# EAGLE design MUX_Adapter (EAGLE 9.5.2)

## Sheet 1 of 2: MUX Routing
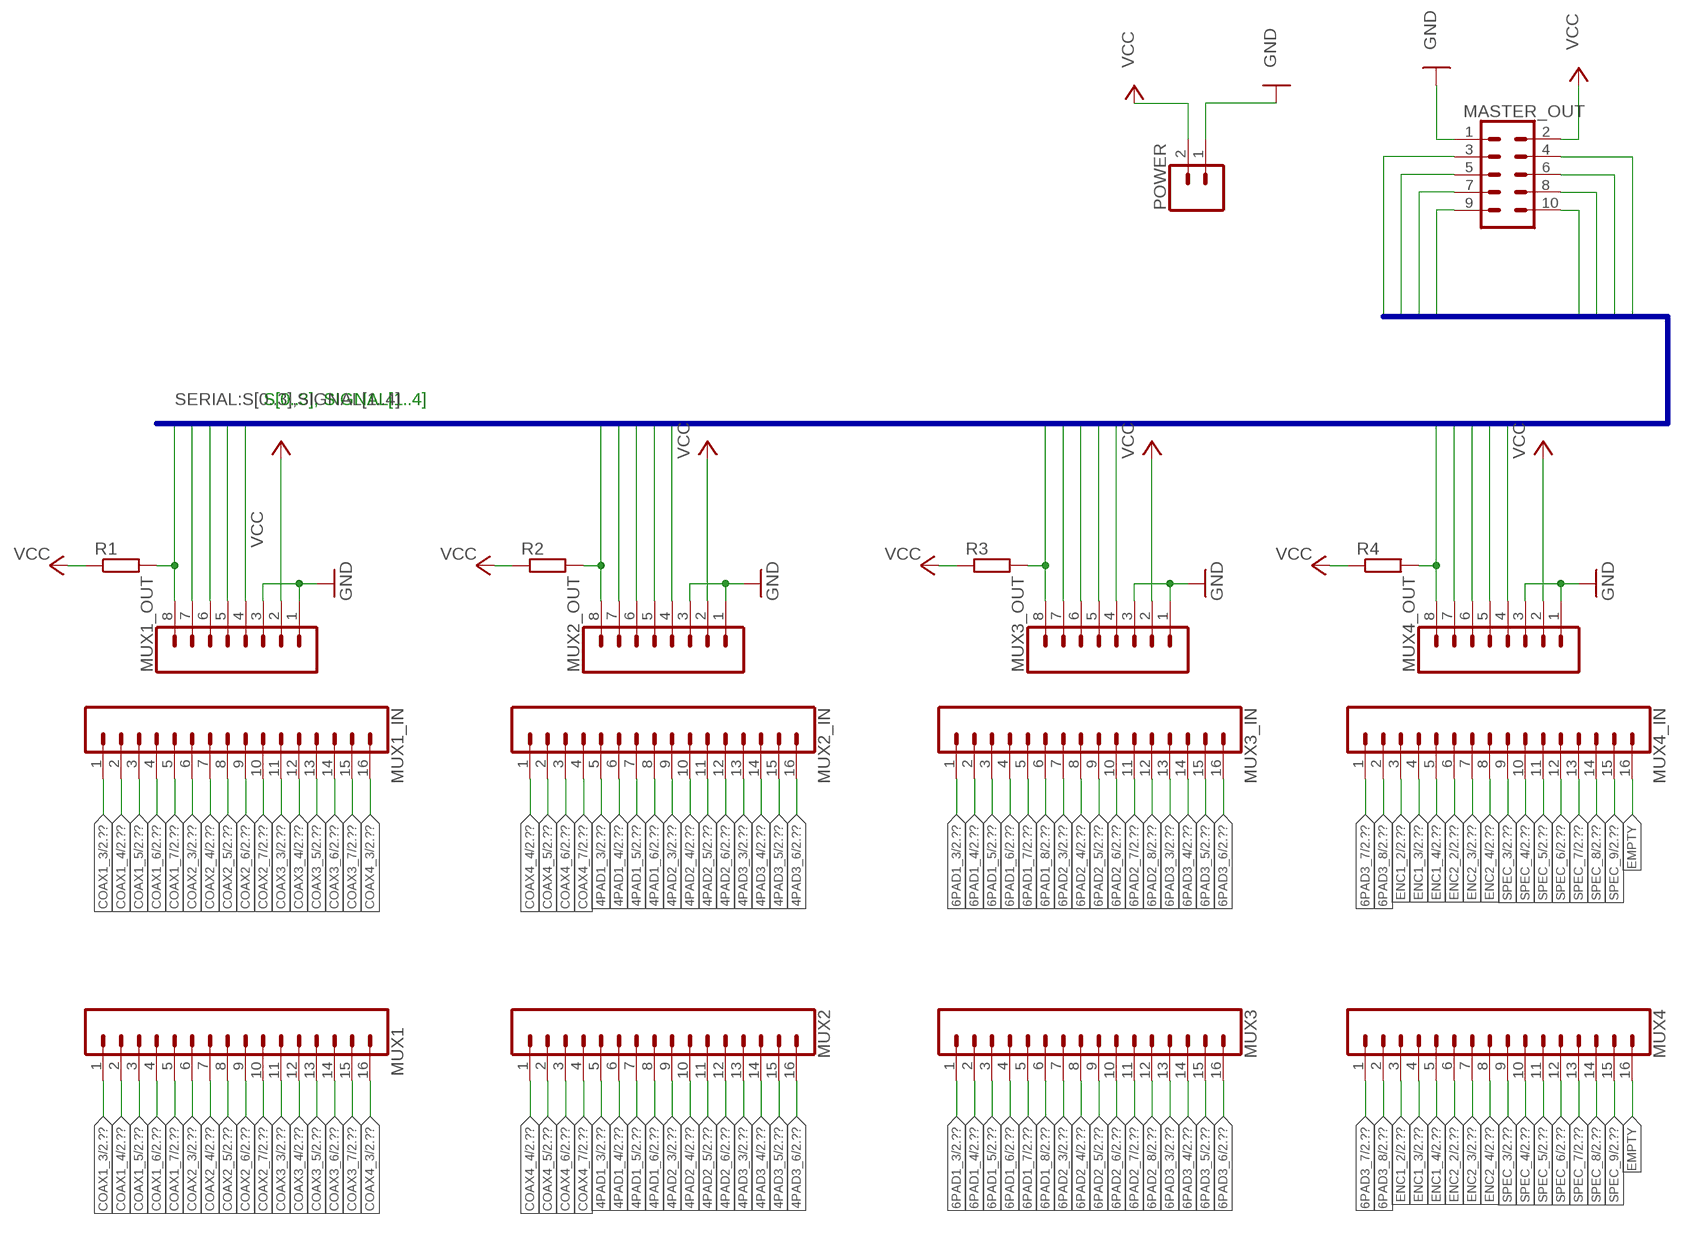
[diagram p0: schematic, sheet 1]

### Parts
MASTER_OUT  CONN_05X2SHD-NS  [2X5-SHROUDED-NS]
MUX1  CONN_16  [1X16]
MUX1_IN  CONN_16  [1X16]
MUX1_OUT  CONN_08"  [1X08]
MUX2  CONN_16  [1X16]
MUX2_IN  CONN_16  [1X16]
MUX2_OUT  CONN_08"  [1X08]
MUX3  CONN_16  [1X16]
MUX3_IN  CONN_16  [1X16]
MUX3_OUT  CONN_08"  [1X08]
MUX4  CONN_16  [1X16]
MUX4_IN  CONN_16  [1X16]
MUX4_OUT  CONN_08"  [1X08]
POWER  CONN_02  [1X02]
R1  R-EU_0207/10  [0207/10]
R2  R-EU_0207/10  [0207/10]
R3  R-EU_0207/10  [0207/10]
R4  R-EU_0207/10  [0207/10]

### Nets
4PAD1_3: MUX2.5 MUX2_IN.5 ; also sheet 2
4PAD1_4: MUX2.6 MUX2_IN.6 ; also sheet 2
4PAD1_5: MUX2.7 MUX2_IN.7 ; also sheet 2
4PAD1_6: MUX2.8 MUX2_IN.8 ; also sheet 2
4PAD2_3: MUX2.9 MUX2_IN.9 ; also sheet 2
4PAD2_4: MUX2.10 MUX2_IN.10 ; also sheet 2
4PAD2_5: MUX2.11 MUX2_IN.11 ; also sheet 2
4PAD2_6: MUX2.12 MUX2_IN.12 ; also sheet 2
4PAD3_3: MUX2.13 MUX2_IN.13 ; also sheet 2
4PAD3_4: MUX2.14 MUX2_IN.14 ; also sheet 2
4PAD3_5: MUX2.15 MUX2_IN.15 ; also sheet 2
4PAD3_6: MUX2.16 MUX2_IN.16 ; also sheet 2
6PAD1_3: MUX3.1 MUX3_IN.1 ; also sheet 2
6PAD1_4: MUX3.2 MUX3_IN.2 ; also sheet 2
6PAD1_5: MUX3.3 MUX3_IN.3 ; also sheet 2
6PAD1_6: MUX3.4 MUX3_IN.4 ; also sheet 2
6PAD1_7: MUX3.5 MUX3_IN.5 ; also sheet 2
6PAD1_8: MUX3.6 MUX3_IN.6 ; also sheet 2
6PAD2_3: MUX3.7 MUX3_IN.7 ; also sheet 2
6PAD2_4: MUX3.8 MUX3_IN.8 ; also sheet 2
6PAD2_5: MUX3.9 MUX3_IN.9 ; also sheet 2
6PAD2_6: MUX3.10 MUX3_IN.10 ; also sheet 2
6PAD2_7: MUX3.11 MUX3_IN.11 ; also sheet 2
6PAD2_8: MUX3.12 MUX3_IN.12 ; also sheet 2
6PAD3_3: MUX3.13 MUX3_IN.13 ; also sheet 2
6PAD3_4: MUX3.14 MUX3_IN.14 ; also sheet 2
6PAD3_5: MUX3.15 MUX3_IN.15 ; also sheet 2
6PAD3_6: MUX3.16 MUX3_IN.16 ; also sheet 2
6PAD3_7: MUX4.1 MUX4_IN.1 ; also sheet 2
6PAD3_8: MUX4.2 MUX4_IN.2 ; also sheet 2
COAX1_3: MUX1.1 MUX1_IN.1 ; also sheet 2
COAX1_4: MUX1.2 MUX1_IN.2 ; also sheet 2
COAX1_5: MUX1.3 MUX1_IN.3 ; also sheet 2
COAX1_6: MUX1.4 MUX1_IN.4 ; also sheet 2
COAX1_7: MUX1.5 MUX1_IN.5 ; also sheet 2
COAX2_3: MUX1.6 MUX1_IN.6 ; also sheet 2
COAX2_4: MUX1.7 MUX1_IN.7 ; also sheet 2
COAX2_5: MUX1.8 MUX1_IN.8 ; also sheet 2
COAX2_6: MUX1.9 MUX1_IN.9 ; also sheet 2
COAX2_7: MUX1.10 MUX1_IN.10 ; also sheet 2
COAX3_3: MUX1.11 MUX1_IN.11 ; also sheet 2
COAX3_4: MUX1.12 MUX1_IN.12 ; also sheet 2
COAX3_5: MUX1.13 MUX1_IN.13 ; also sheet 2
COAX3_6: MUX1.14 MUX1_IN.14 ; also sheet 2
COAX3_7: MUX1.15 MUX1_IN.15 ; also sheet 2
COAX4_3: MUX1.16 MUX1_IN.16 ; also sheet 2
COAX4_4: MUX2.1 MUX2_IN.1 ; also sheet 2
COAX4_5: MUX2.2 MUX2_IN.2 ; also sheet 2
COAX4_6: MUX2.3 MUX2_IN.3 ; also sheet 2
COAX4_7: MUX2.4 MUX2_IN.4 ; also sheet 2
EMPTY: MUX4.16 MUX4_IN.16
ENC1_2: MUX4.3 MUX4_IN.3 ; also sheet 2
ENC1_3: MUX4.4 MUX4_IN.4 ; also sheet 2
ENC1_4: MUX4.5 MUX4_IN.5 ; also sheet 2
ENC2_2: MUX4.6 MUX4_IN.6 ; also sheet 2
ENC2_3: MUX4.7 MUX4_IN.7 ; also sheet 2
ENC2_4: MUX4.8 MUX4_IN.8 ; also sheet 2
GND: MASTER_OUT.1 MUX1_OUT.1 MUX1_OUT.3 MUX2_OUT.1 MUX2_OUT.3 MUX3_OUT.1 MUX3_OUT.3 MUX4_OUT.1 MUX4_OUT.3 POWER.1 ; also sheet 2
S0: MASTER_OUT.3 MUX1_OUT.4 MUX2_OUT.4 MUX3_OUT.4 MUX4_OUT.4
S1: MASTER_OUT.4 MUX1_OUT.5 MUX2_OUT.5 MUX3_OUT.5 MUX4_OUT.5
S2: MASTER_OUT.5 MUX1_OUT.6 MUX2_OUT.6 MUX3_OUT.6 MUX4_OUT.6
S3: MASTER_OUT.6 MUX1_OUT.7 MUX2_OUT.7 MUX3_OUT.7 MUX4_OUT.7
SIGNAL1: MASTER_OUT.7 MUX4_OUT.8 R4.2
SIGNAL2: MASTER_OUT.8 MUX3_OUT.8 R3.2
SIGNAL3: MASTER_OUT.9 MUX2_OUT.8 R2.2
SIGNAL4: MASTER_OUT.10 MUX1_OUT.8 R1.2
SPEC_3: MUX4.9 MUX4_IN.9 ; also sheet 2
SPEC_4: MUX4.10 MUX4_IN.10 ; also sheet 2
SPEC_5: MUX4.11 MUX4_IN.11 ; also sheet 2
SPEC_6: MUX4.12 MUX4_IN.12 ; also sheet 2
SPEC_7: MUX4.13 MUX4_IN.13 ; also sheet 2
SPEC_8: MUX4.14 MUX4_IN.14 ; also sheet 2
SPEC_9: MUX4.15 MUX4_IN.15 ; also sheet 2
VCC: MASTER_OUT.2 MUX1_OUT.2 MUX2_OUT.2 MUX3_OUT.2 MUX4_OUT.2 POWER.2 R1.1 R2.1 R3.1 R4.1 ; also sheet 2

### Buses
SERIAL:S[0..3],SIGNAL[1..4]

### Notes on the sheet
- S[0..3], SIGNAL[1..4]

## Sheet 2 of 2: Connecors
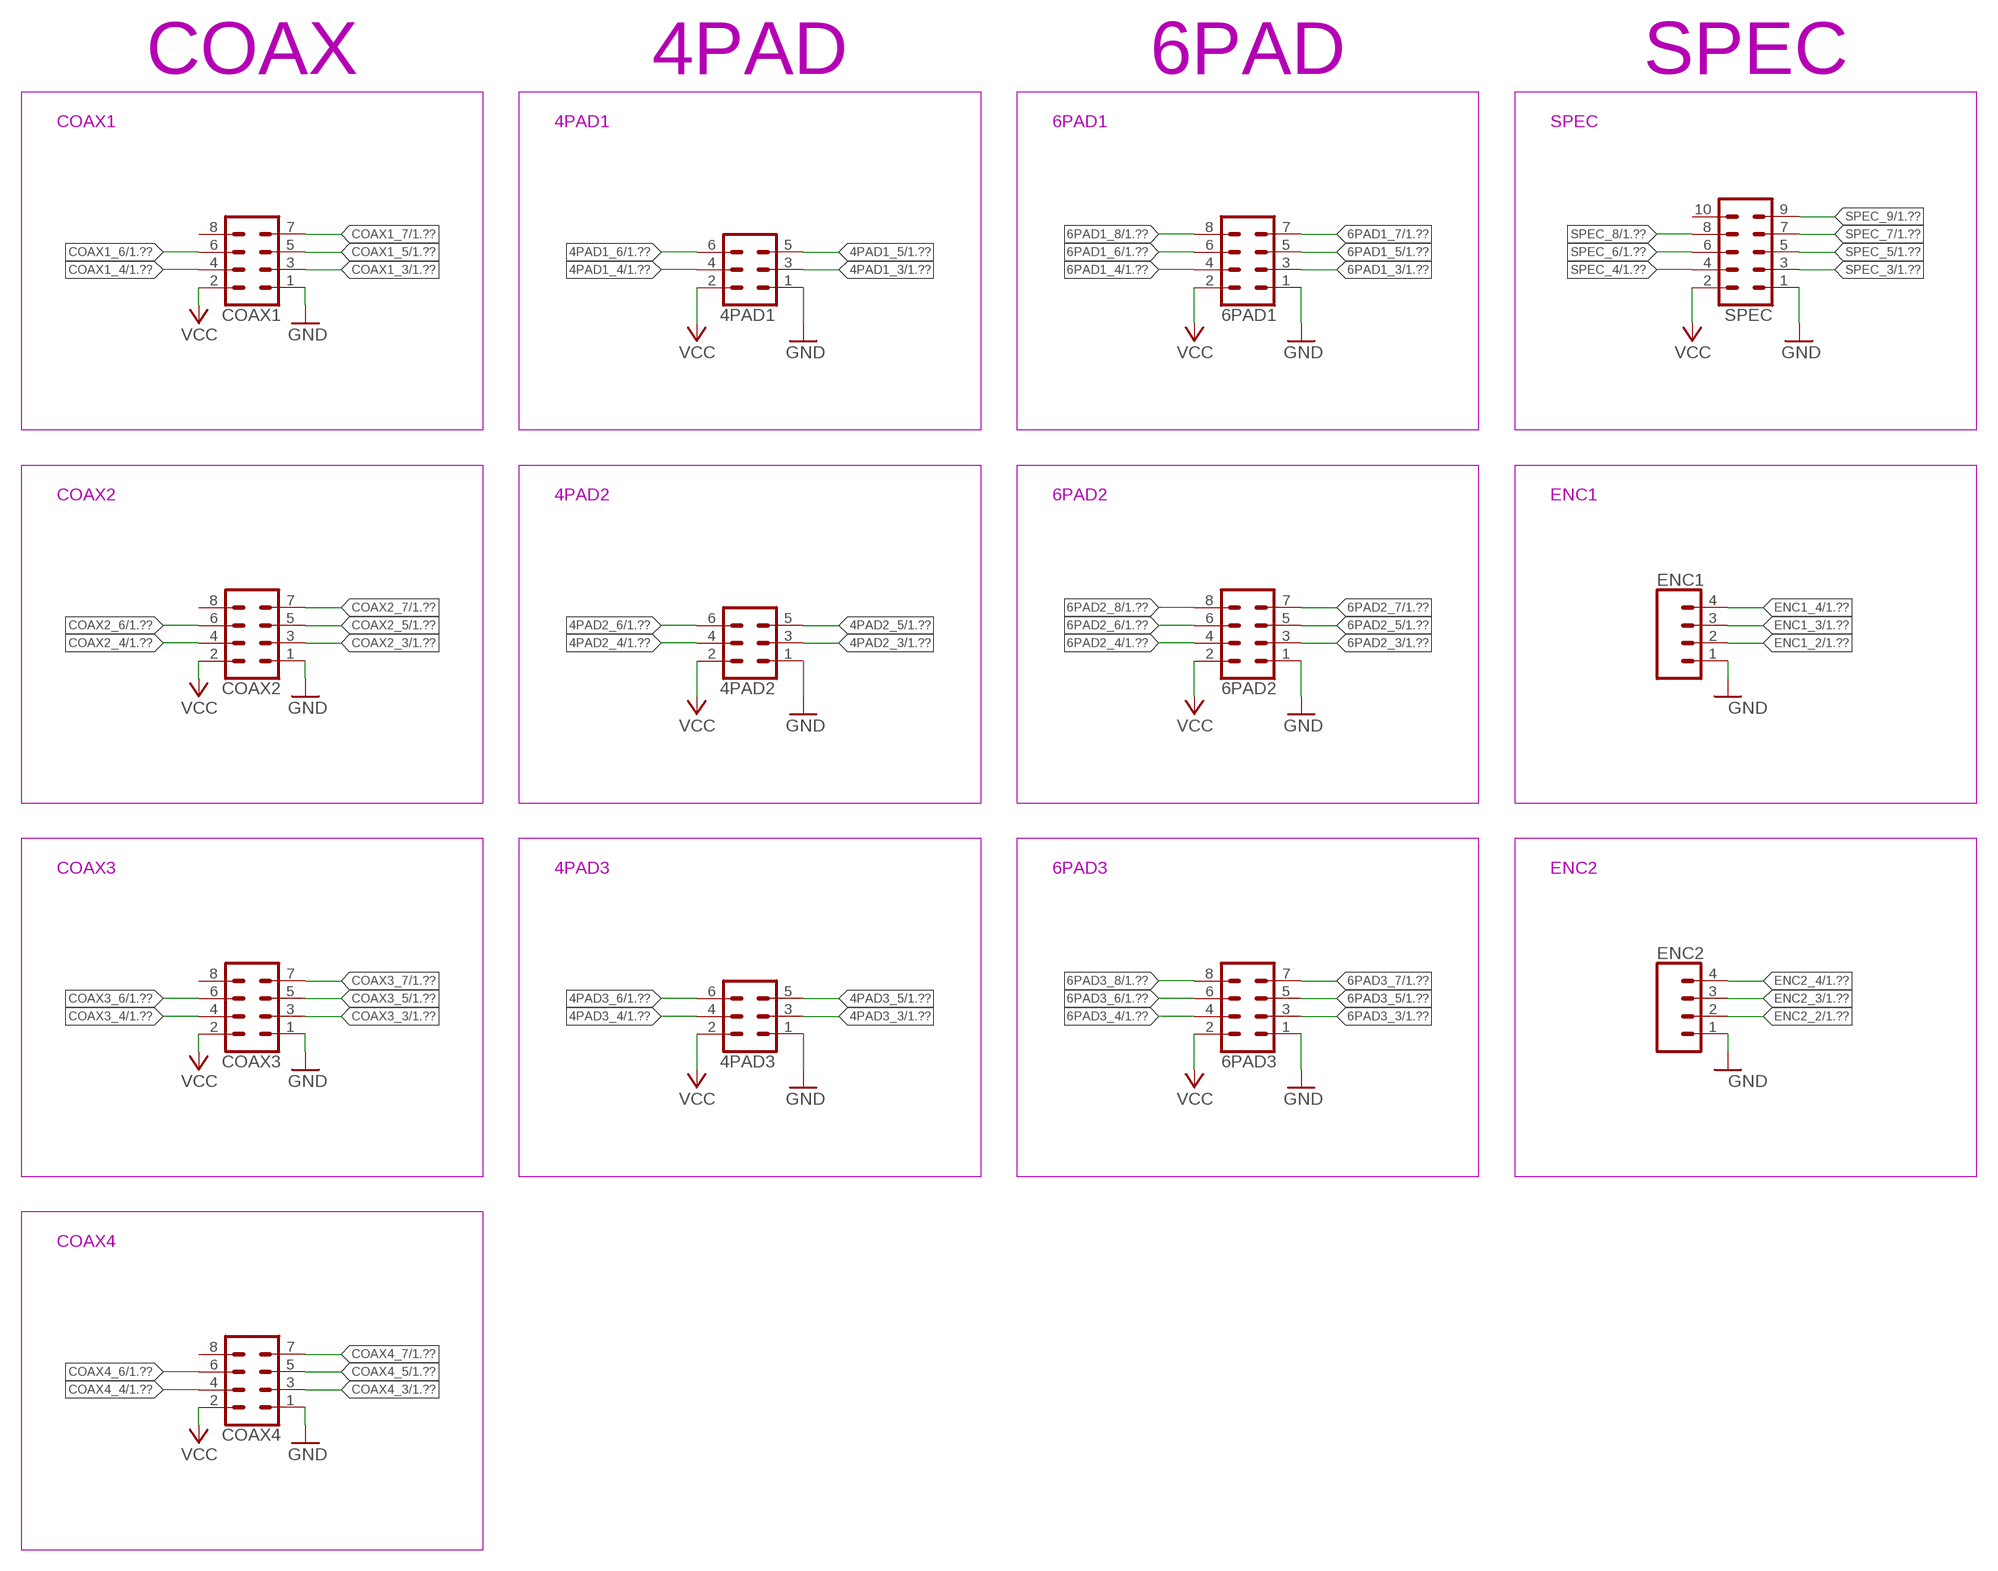
[diagram p1: schematic, sheet 2]

### Parts
4PAD1  CONN_03X2NO_SILK  [2X3-NS]
4PAD2  CONN_03X2NO_SILK  [2X3-NS]
4PAD3  CONN_03X2NO_SILK  [2X3-NS]
6PAD1  CONN_04X2  [2X4]
6PAD2  CONN_04X2  [2X4]
6PAD3  CONN_04X2  [2X4]
COAX1  CONN_04X2  [2X4]
COAX2  CONN_04X2  [2X4]
COAX3  CONN_04X2  [2X4]
COAX4  CONN_04X2  [2X4]
ENC1  CONN_04PTH  [1X04]
ENC2  CONN_04PTH  [1X04]
SPEC  CONN_05X2PTH  [2X5]

### Nets
4PAD1_3: 4PAD1.3 ; also sheet 1
4PAD1_4: 4PAD1.4 ; also sheet 1
4PAD1_5: 4PAD1.5 ; also sheet 1
4PAD1_6: 4PAD1.6 ; also sheet 1
4PAD2_3: 4PAD2.3 ; also sheet 1
4PAD2_4: 4PAD2.4 ; also sheet 1
4PAD2_5: 4PAD2.5 ; also sheet 1
4PAD2_6: 4PAD2.6 ; also sheet 1
4PAD3_3: 4PAD3.3 ; also sheet 1
4PAD3_4: 4PAD3.4 ; also sheet 1
4PAD3_5: 4PAD3.5 ; also sheet 1
4PAD3_6: 4PAD3.6 ; also sheet 1
6PAD1_3: 6PAD1.3 ; also sheet 1
6PAD1_4: 6PAD1.4 ; also sheet 1
6PAD1_5: 6PAD1.5 ; also sheet 1
6PAD1_6: 6PAD1.6 ; also sheet 1
6PAD1_7: 6PAD1.7 ; also sheet 1
6PAD1_8: 6PAD1.8 ; also sheet 1
6PAD2_3: 6PAD2.3 ; also sheet 1
6PAD2_4: 6PAD2.4 ; also sheet 1
6PAD2_5: 6PAD2.5 ; also sheet 1
6PAD2_6: 6PAD2.6 ; also sheet 1
6PAD2_7: 6PAD2.7 ; also sheet 1
6PAD2_8: 6PAD2.8 ; also sheet 1
6PAD3_3: 6PAD3.3 ; also sheet 1
6PAD3_4: 6PAD3.4 ; also sheet 1
6PAD3_5: 6PAD3.5 ; also sheet 1
6PAD3_6: 6PAD3.6 ; also sheet 1
6PAD3_7: 6PAD3.7 ; also sheet 1
6PAD3_8: 6PAD3.8 ; also sheet 1
COAX1_3: COAX1.3 ; also sheet 1
COAX1_4: COAX1.4 ; also sheet 1
COAX1_5: COAX1.5 ; also sheet 1
COAX1_6: COAX1.6 ; also sheet 1
COAX1_7: COAX1.7 ; also sheet 1
COAX2_3: COAX2.3 ; also sheet 1
COAX2_4: COAX2.4 ; also sheet 1
COAX2_5: COAX2.5 ; also sheet 1
COAX2_6: COAX2.6 ; also sheet 1
COAX2_7: COAX2.7 ; also sheet 1
COAX3_3: COAX3.3 ; also sheet 1
COAX3_4: COAX3.4 ; also sheet 1
COAX3_5: COAX3.5 ; also sheet 1
COAX3_6: COAX3.6 ; also sheet 1
COAX3_7: COAX3.7 ; also sheet 1
COAX4_3: COAX4.3 ; also sheet 1
COAX4_4: COAX4.4 ; also sheet 1
COAX4_5: COAX4.5 ; also sheet 1
COAX4_6: COAX4.6 ; also sheet 1
COAX4_7: COAX4.7 ; also sheet 1
ENC1_2: ENC1.2 ; also sheet 1
ENC1_3: ENC1.3 ; also sheet 1
ENC1_4: ENC1.4 ; also sheet 1
ENC2_2: ENC2.2 ; also sheet 1
ENC2_3: ENC2.3 ; also sheet 1
ENC2_4: ENC2.4 ; also sheet 1
GND: 4PAD1.1 4PAD2.1 4PAD3.1 6PAD1.1 6PAD2.1 6PAD3.1 COAX1.1 COAX2.1 COAX3.1 COAX4.1 ENC1.1 ENC2.1 SPEC.1 ; also sheet 1
SPEC_3: SPEC.3 ; also sheet 1
SPEC_4: SPEC.4 ; also sheet 1
SPEC_5: SPEC.5 ; also sheet 1
SPEC_6: SPEC.6 ; also sheet 1
SPEC_7: SPEC.7 ; also sheet 1
SPEC_8: SPEC.8 ; also sheet 1
SPEC_9: SPEC.9 ; also sheet 1
VCC: 4PAD1.2 4PAD2.2 4PAD3.2 6PAD1.2 6PAD2.2 6PAD3.2 COAX1.2 COAX2.2 COAX3.2 COAX4.2 SPEC.2 ; also sheet 1
Unconnected: COAX1.8 COAX2.8 COAX3.8 COAX4.8 SPEC.10

### Notes on the sheet
- COAX | 4PAD | 6PAD | SPEC
- COAX1 | 4PAD1 | 6PAD1 | SPEC
- COAX2 | 4PAD2 | 6PAD2 | ENC1
- COAX3 | 4PAD3 | 6PAD3 | ENC2
- COAX4

## Library data of the parts
4PAD1-4PAD3 = SparkFun-Connectors:CONN_03X2: Multi connection point. Often used as Generic Header-pin footprint for 0.1 inch spaced/style header connections You can populate with any combo of single row headers, but if you'd like an exact match, check these: Header - 2x3 (Male, 0.1") <https://www.sparkfun.com/products/12807> (PRT-12807) Header - 2x3 (Female, 0.1") <https://www.sparkfun.com/products/13010> (PRT-13010) 2x3 Pin Shrouded Header <https://www.sparkfun.com/products/10877> (PRT-10877) On any of the 0.1 inch spaced packages, you can populate with these: Break Away Headers - Straight <https://www.sparkfun.com/products/116> (PRT-00116) Break Away Male Headers - Right Angle <https://www.sparkfun.com/products/553> (PRT-00553) Female Headers <https://www.sparkfun.com/products/115> (PRT-00115) Break Away Headers - Machine Pin <https://www.sparkfun.com/products/117> (PRT-00117) Break Away Female Headers - Swiss Machine Pin <https://www.sparkfun.com/products/743> (PRT-00743) Special note: the shrouded connector mates well with our 3x2 ribbon cables: Ribbon Crimp Connector - 6-pin (2x3, Female) <https://www.sparkfun.com/products/10651> (PRT-10651) Ribbon Cable - 6 wire (15ft) <https://www.sparkfun.com/products/10646> (PRT-10646)
6PAD1-6PAD3 COAX1-COAX4 = SparkFun-Connectors:CONN_04X2: Multi connection point. Often used as Generic Header-pin footprint for 0.1 inch spaced/style header connections On any of the 0.1 inch spaced packages, you can populate with these: Break Away Headers - Straight <https://www.sparkfun.com/products/116> (PRT-00116) Break Away Male Headers - Right Angle <https://www.sparkfun.com/products/553> (PRT-00553) Female Headers <https://www.sparkfun.com/products/115> (PRT-00115) Break Away Headers - Machine Pin <https://www.sparkfun.com/products/117> (PRT-00117) Break Away Female Headers - Swiss Machine Pin <https://www.sparkfun.com/products/743> (PRT-00743)
ENC1 ENC2 = SparkFun-Connectors:CONN_04: Multi connection point. Often used as Generic Header-pin footprint for 0.1 inch spaced/style header connections On any of the 0.1 inch spaced packages, you can populate with these: Break Away Headers - Straight <https://www.sparkfun.com/products/116> (PRT-00116) Break Away Male Headers - Right Angle <https://www.sparkfun.com/products/553> (PRT-00553) Female Headers <https://www.sparkfun.com/products/115> (PRT-00115) Break Away Headers - Machine Pin <https://www.sparkfun.com/products/117> (PRT-00117) Break Away Female Headers - Swiss Machine Pin <https://www.sparkfun.com/products/743> (PRT-00743) For SCREWTERMINALS and SPRING TERMINALS visit here: Screw Terimnals on SparkFun.com <https://www.sparkfun.com/search/results?term=Screw+Terminals> (5mm/3.5mm/2.54mm spacing) This device is also useful as a general connection point to wire up your design to another part of your project. Our various solder wires solder well into these plated through hole pads. Hook-Up Wire - Assortment (Stranded, 22 AWG) <https://www.sparkfun.com/products/11375> (PRT-11375) Hook-Up Wire - Assortment (Solid Core, 22 AWG) <https://www.sparkfun.com/products/11367> (PRT-11367) View the entire wire category on our website here <https://www.sparkfun.com/categories/141> Special notes: Molex polarized connector foot print use with SKU : PRT-08231 with associated crimp pins and housings. 1MM SMD Version SKU: PRT-10208; PROD_ID: CONN-09696
MASTER_OUT = SparkFun-Connectors:CONN_05X2: Multi connection point. Often used as Generic Header-pin footprint for 0.1 inch spaced/style header connections For AVR SPI programming port, see special device with nice symbol: "AVR_SPI_PROG_5x2.dev" You can populate with any combo of single row headers, but if you'd like an exact match, check these: 2x5 AVR ICSP Male Header <https://www.sparkfun.com/products/778> (PRT-00778) 2x5 Pin Shrouded Header <https://www.sparkfun.com/products/8506> (PRT-08506) On any of the 0.1 inch spaced packages, you can populate with these: Break Away Headers - Straight <https://www.sparkfun.com/products/116> (PRT-00116) Break Away Male Headers - Right Angle <https://www.sparkfun.com/products/553> (PRT-00553) Female Headers <https://www.sparkfun.com/products/115> (PRT-00115) Break Away Headers - Machine Pin <https://www.sparkfun.com/products/117> (PRT-00117) Break Away Female Headers - Swiss Machine Pin <https://www.sparkfun.com/products/743> (PRT-00743) Special note: the shrouded connector mates well with our 5x2 ribbon cables: 2x5 Pin IDC Ribbon Cable <https://www.sparkfun.com/products/8535> (PRT-08535); PROD_ID: CONN-08671; SF_ID: PRT-08506
MUX1 MUX1_IN MUX2 MUX2_IN MUX3 MUX3_IN MUX4 MUX4_IN = SparkFun-Connectors:CONN_16: Multi connection point. Often used as Generic Header-pin footprint for 0.1 inch spaced/style header connections On any of the 0.1 inch spaced packages, you can populate with these: Break Away Headers - Straight <https://www.sparkfun.com/products/116> (PRT-00116) Break Away Male Headers - Right Angle <https://www.sparkfun.com/products/553> (PRT-00553) Female Headers <https://www.sparkfun.com/products/115> (PRT-00115) Break Away Headers - Machine Pin <https://www.sparkfun.com/products/117> (PRT-00117) Break Away Female Headers - Swiss Machine Pin <https://www.sparkfun.com/products/743> (PRT-00743) For SCREWTERMINALS and SPRING TERMINALS visit here: Screw Terimnals on SparkFun.com <https://www.sparkfun.com/search/results?term=Screw+Terminals> (5mm/3.5mm/2.54mm spacing) This device is also useful as a general connection point to wire up your design to another part of your project. Our various solder wires solder well into these plated through hole pads. Hook-Up Wire - Assortment (Stranded, 22 AWG) <https://www.sparkfun.com/products/11375> (PRT-11375) Hook-Up Wire - Assortment (Solid Core, 22 AWG) <https://www.sparkfun.com/products/11367> (PRT-11367) View the entire wire category on our website here <https://www.sparkfun.com/categories/141> Special notes: Molex polarized connector foot print use with SKU : PRT-08231 with associated crimp pins and housings. 1MM SMD Version SKU: PRT-10208 NOTES ON THE VARIANTS LOCK and LOCK_LONGPADS... This footprint was designed to help hold the alignment of a through-hole component (i.e. 6-pin header) while soldering it into place. You may notice that each hole has been shifted either up or down by 0.005 of an inch from it's more standard position (which is a perfectly straight line). This slight alteration caused the pins (the squares in the middle) to touch the edges of the holes. Because they are alternating, it causes a "brace" to hold the component in place. 0.005 has proven to be the perfect amount of "off-center" position when using our standard breakaway headers. Although looks a little odd when you look at the bare footprint, once you have a header in there, the alteration is very hard to notice. Also,if you push a header all the way into place, it is covered up entirely on the bottom side.
MUX1_OUT MUX2_OUT MUX3_OUT MUX4_OUT = SparkFun-Connectors:CONN_08: Multi connection point. Often used as Generic Header-pin footprint for 0.1 inch spaced/style header connections On any of the 0.1 inch spaced packages, you can populate with these: Break Away Headers - Straight <https://www.sparkfun.com/products/116> (PRT-00116) Break Away Male Headers - Right Angle <https://www.sparkfun.com/products/553> (PRT-00553) Female Headers <https://www.sparkfun.com/products/115> (PRT-00115) Break Away Headers - Machine Pin <https://www.sparkfun.com/products/117> (PRT-00117) Break Away Female Headers - Swiss Machine Pin <https://www.sparkfun.com/products/743> (PRT-00743) Arduino Stackable Header - 8 Pin <https://www.sparkfun.com/products/9279> (PRT-09279) For SCREWTERMINALS and SPRING TERMINALS visit here: Screw Terimnals on SparkFun.com <https://www.sparkfun.com/search/results?term=Screw+Terminals> (5mm/3.5mm/2.54mm spacing) This device is also useful as a general connection point to wire up your design to another part of your project. Our various solder wires solder well into these plated through hole pads. Hook-Up Wire - Assortment (Stranded, 22 AWG) <https://www.sparkfun.com/products/11375> (PRT-11375) Hook-Up Wire - Assortment (Solid Core, 22 AWG) <https://www.sparkfun.com/products/11367> (PRT-11367) View the entire wire category on our website here <https://www.sparkfun.com/categories/141> Special notes: Molex polarized connector foot print use with SKU : PRT-08231 with associated crimp pins and housings. 1MM SMD Version SKU: PRT-10208 NOTES ON THE VARIANTS LOCK and LOCK_LONGPADS... This footprint was designed to help hold the alignment of a through-hole component (i.e. 6-pin header) while soldering it into place. You may notice that each hole has been shifted either up or down by 0.005 of an inch from it's more standard position (which is a perfectly straight line). This slight alteration caused the pins (the squares in the middle) to touch the edges of the holes. Because they are alternating, it causes a "brace" to hold the component in place. 0.005 has proven to be the perfect amount of "off-center" position when using our standard breakaway headers. Although looks a little odd when you look at the bare footprint, once you have a header in there, the alteration is very hard to notice. Also,if you push a header all the way into place, it is covered up entirely on the bottom side.; PROD_ID: CONN-08438
POWER = SparkFun-Connectors:CONN_02: Multi connection point. Often used as Generic Header-pin footprint for 0.1 inch spaced/style header connections On any of the 0.1 inch spaced packages, you can populate with these: Break Away Headers - Straight <https://www.sparkfun.com/products/116> (PRT-00116) Break Away Male Headers - Right Angle <https://www.sparkfun.com/products/553> (PRT-00553) Female Headers <https://www.sparkfun.com/products/115> (PRT-00115) Break Away Headers - Machine Pin <https://www.sparkfun.com/products/117> (PRT-00117) Break Away Female Headers - Swiss Machine Pin <https://www.sparkfun.com/products/743> (PRT-00743) For SCREWTERMINALS and SPRING TERMINALS visit here: Screw Terimnals on SparkFun.com <https://www.sparkfun.com/search/results?term=Screw+Terminals> (5mm/3.5mm/2.54mm spacing) This device is also useful as a general connection point to wire up your design to another part of your project. Our various solder wires solder well into these plated through hole pads. Hook-Up Wire - Assortment (Stranded, 22 AWG) <https://www.sparkfun.com/products/11375> (PRT-11375) Hook-Up Wire - Assortment (Solid Core, 22 AWG) <https://www.sparkfun.com/products/11367> (PRT-11367) View the entire wire category on our website here <https://www.sparkfun.com/categories/141> Special notes: Molex polarized connector foot print use with: PRT-08233 with associated crimp pins and housings. 2.54_SCREWTERM for use with PRT-10571. 3.5mm Screw Terminal footprints for PRT-08084 5mm Screw Terminal footprints for use with PRT-08432
R1-R4 = rcl:R-EU_: RESISTOR, European symbol; SPICEPREFIX: R
SPEC = SparkFun-Connectors:CONN_05X2: Multi connection point. Often used as Generic Header-pin footprint for 0.1 inch spaced/style header connections For AVR SPI programming port, see special device with nice symbol: "AVR_SPI_PROG_5x2.dev" You can populate with any combo of single row headers, but if you'd like an exact match, check these: 2x5 AVR ICSP Male Header <https://www.sparkfun.com/products/778> (PRT-00778) 2x5 Pin Shrouded Header <https://www.sparkfun.com/products/8506> (PRT-08506) On any of the 0.1 inch spaced packages, you can populate with these: Break Away Headers - Straight <https://www.sparkfun.com/products/116> (PRT-00116) Break Away Male Headers - Right Angle <https://www.sparkfun.com/products/553> (PRT-00553) Female Headers <https://www.sparkfun.com/products/115> (PRT-00115) Break Away Headers - Machine Pin <https://www.sparkfun.com/products/117> (PRT-00117) Break Away Female Headers - Swiss Machine Pin <https://www.sparkfun.com/products/743> (PRT-00743) Special note: the shrouded connector mates well with our 5x2 ribbon cables: 2x5 Pin IDC Ribbon Cable <https://www.sparkfun.com/products/8535> (PRT-08535); PROD_ID: CONN-08499; SF_ID: PRT-0778

## Board
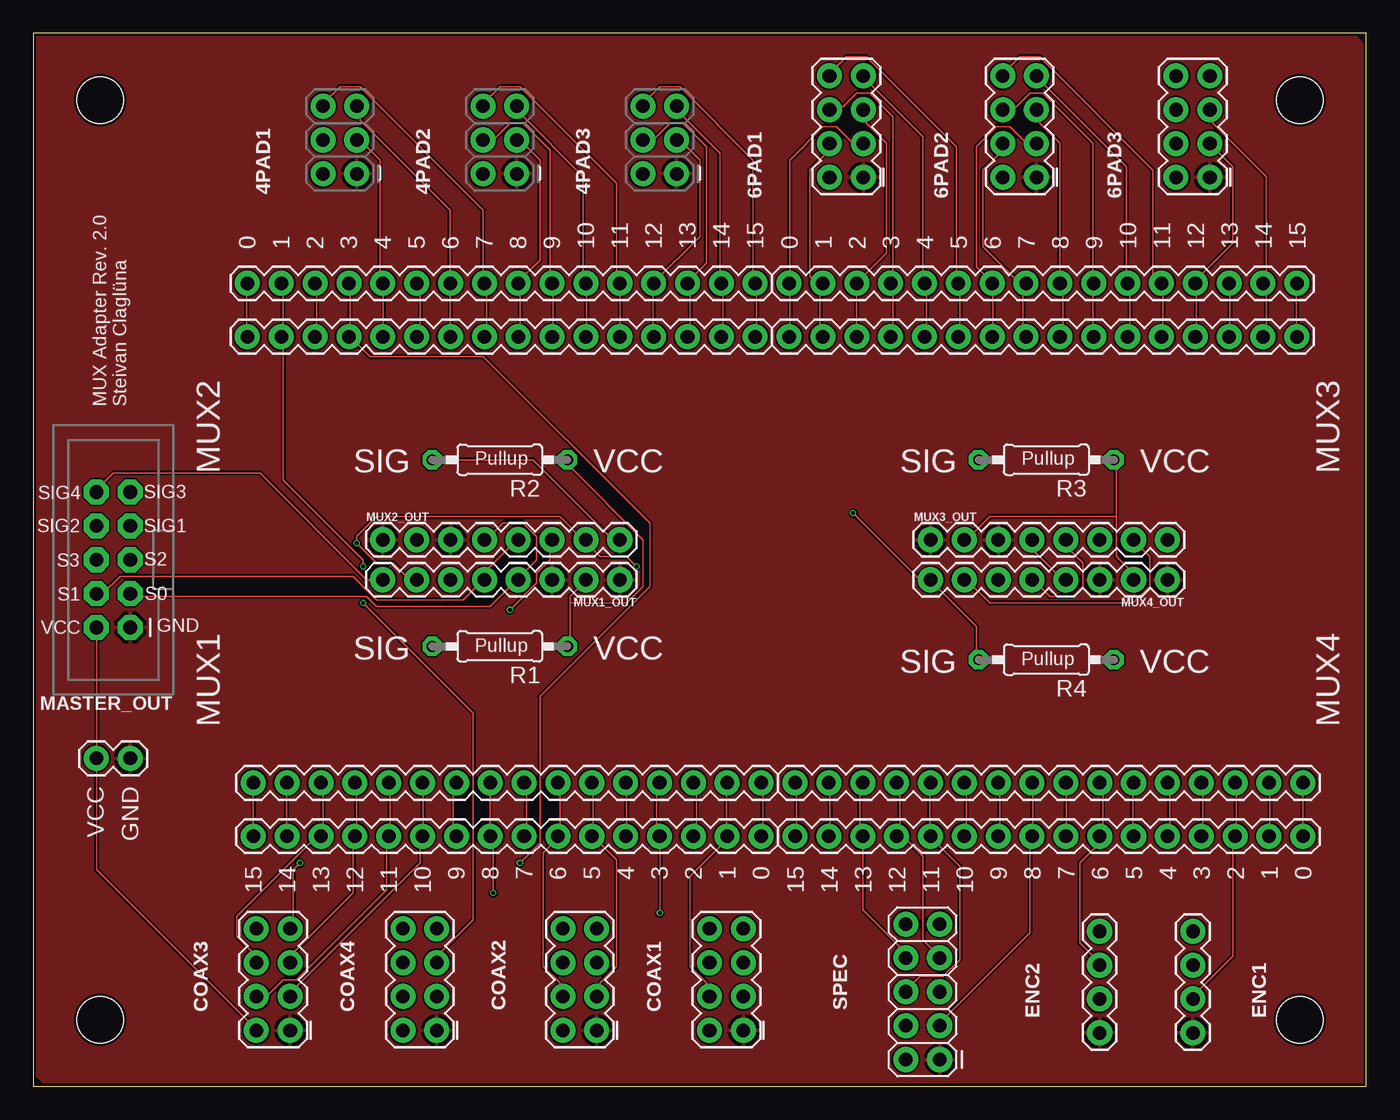
[diagram p2: board, top side]
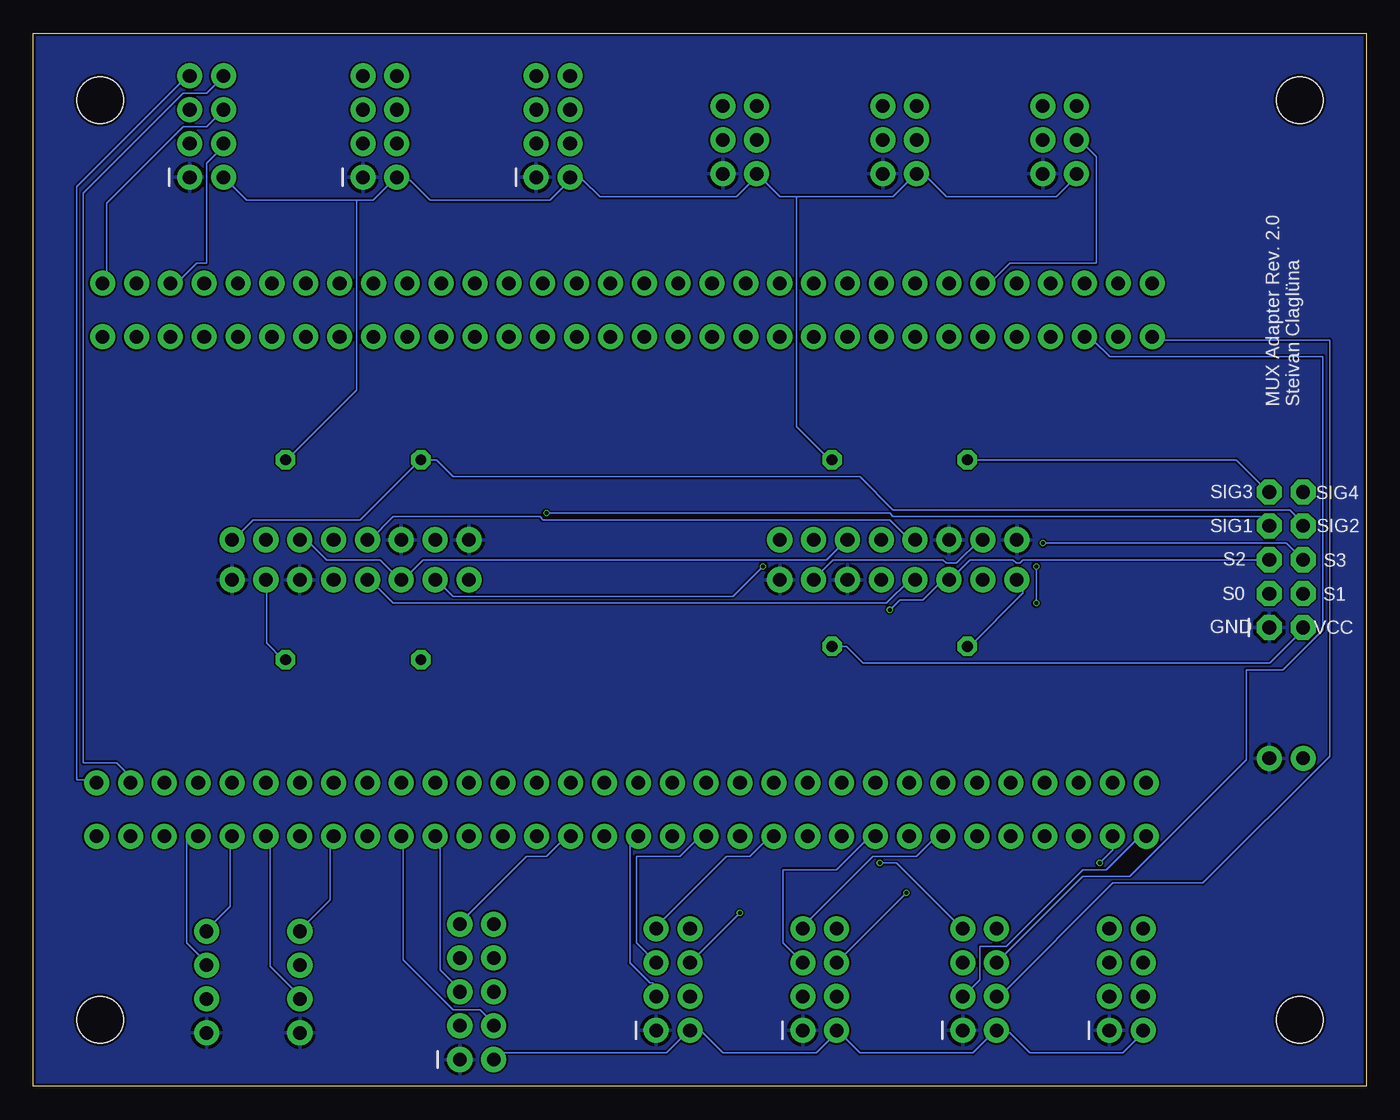
[diagram p3: board, bottom side, seen from below]

Size 100 x 79 mm. Coordinates in mm from the lower left corner, seen from the top.
Outline: 0,0 100,0 100,79 0,79 0,0
Copper layers (1*16): Top 0.035mm / dielectric 1.6mm / Bottom 0.035mm
Design rules "jlcpcb-2layers": minimum track width 5mil, minimum drill 0.3mm, track to track 5mil, track to pad 5mil, pad to pad 5mil, via to via 5mil, smd to smd 5mil, copper to edge 0.2mm, drill to drill 6mil, minimum pad ring 10mil, minimum via ring 3mil, stop-mask expansion 4mil, vias tented up to drill 0mil, thermal gap 10mil
Holes 3.5 mm at 5,74 5,5 95,74 95,5

### Footprints (pad centres in the part's own frame; a part is rotated, then mirrored left to right if it is on the bottom)
2X3-NS = drill 1.016 pad 1.88: 1 -2.54,-1.27; 2 -2.54,1.27; 3 0,-1.27; 4 0,1.27; 5 2.54,-1.27; 6 2.54,1.27
2X4 = drill 1.016 pad 1.88: 1 -3.81,-1.27; 2 -3.81,1.27; 3 -1.27,-1.27; 4 -1.27,1.27; 5 1.27,-1.27; 6 1.27,1.27; 7 3.81,-1.27; 8 3.81,1.27
1X04 = drill 1.016 pad 1.88: 1 0,0; 2 2.54,0; 3 5.08,0; 4 7.62,0
2X5-SHROUDED-NS = drill 1.016 pad 1.88 octagon: 1 -1.27,5.08; 2 1.27,5.08; 3 -1.27,2.54; 4 1.27,2.54; 5 -1.27,0; 6 1.27,0; 7 -1.27,-2.54; 8 1.27,-2.54; 9 -1.27,-5.08; 10 1.27,-5.08
1X16 = drill 1.016 pad 1.88: 1 0,0; 2 2.54,0; 3 5.08,0; 4 7.62,0; 5 10.16,0; 6 12.7,0; 7 15.24,0; 8 17.78,0; 9 20.32,0; 10 22.86,0; 11 25.4,0; 12 27.94,0; 13 30.48,0; 14 33.02,0; 15 35.56,0; 16 38.1,0
1X08 = drill 1.016 pad 1.88: 1 0,0; 2 2.54,0; 3 5.08,0; 4 7.62,0; 5 10.16,0; 6 12.7,0; 7 15.24,0; 8 17.78,0
1X02 = drill 1.016 pad 1.88: 1 0,0; 2 2.54,0
0207/10 = drill 0.813 octagon: 1 -5.08,0; 2 5.08,0
2X5 = drill 1.016 pad 1.88: 1 0,0; 2 0,2.54; 3 2.54,0; 4 2.54,2.54; 5 5.08,0; 6 5.08,2.54; 7 7.62,0; 8 7.62,2.54; 9 10.16,0; 10 10.16,2.54

### Placement (x,y rotation side)
4PAD1  23,71 90 top
4PAD2  35,71 90 top
4PAD3  47,71 90 top
6PAD1  61,72 90 top
6PAD2  74,72 90 top
6PAD3  87,72 90 top
COAX1  52,8 90 top
COAX2  41,8 90 top
COAX3  18,8 90 top
COAX4  29,8 90 top
ENC1  87,4 90 top
ENC2  80,4 90 top
MASTER_OUT  6,39.5 180 top
MUX1  54.6,18.76 180 top
MUX1_IN  54.6,22.76 180 top
MUX1_OUT  44,38 180 top
MUX2  16.06,56.24 0 top
MUX2_IN  16.06,60.24 0 top
MUX2_OUT  26.22,41 0 top
MUX3  56.7,60.24 0 top
MUX3_IN  56.7,56.24 0 top
MUX3_OUT  67.31,41 0 top
MUX4  95.25,22.76 180 top
MUX4_IN  95.25,18.76 180 top
MUX4_OUT  85.09,38 180 top
POWER  7.27,24.6 180 top
R1  35,33 180 top
R2  35,47 180 top
R3  76,47 180 top
R4  76,32 180 top
SPEC  68,2 90 top

### Tracks (layer width: path | path; a pad name or v marks a point on that pad's centre or on a via)
4PAD1_3
  Top 0.127: MUX2.5 26.25,56.25 26.25,60 MUX2_IN.5 26,60.25 26,69.5 24.5,71 4PAD1.3
4PAD1_4
  Top 0.127: MUX2.6 29,56.25 29,60 MUX2_IN.6
  Bottom 0.127: 4PAD1.4 21.5,71 20.25,69.75 20.25,61.75 26.75,61.75 28.25,60.25 MUX2_IN.6
4PAD1_5
  Top 0.127: MUX2.7 31.25,56.25 31.25,60 MUX2_IN.7 31.25,60.25 31.25,65.75 24.5,72.5 24.5,73.5 4PAD1.5
4PAD1_6
  Top 0.127: MUX2.8 34,56.25 34,60 MUX2_IN.8 33.75,60.25 33.75,65.75 24.5,75 23,75 21.75,73.75 4PAD1.6
4PAD2_3
  Top 0.127: MUX2.9 36.5,56.25 36.5,60 MUX2_IN.9 36.25,60.25 38,62 38,69.5 36.5,71 4PAD2.3
4PAD2_4
  Top 0.127: MUX2.10 39,56.25 39,60 MUX2_IN.10 38.75,60.25 38.75,70.25 36.75,72.25 35.75,72.25 34.5,71 4PAD2.4
4PAD2_5
  Top 0.127: MUX2.11 41.5,56.25 41.5,60 MUX2_IN.11 41.25,60.25 41.25,68.25 36.5,73 36.5,73.5 4PAD2.5
4PAD2_6
  Top 0.127: MUX2.12 MUX2_IN.12 43.75,60.5 43.75,67.75 36.5,75 35,75 33.75,73.75 4PAD2.6
4PAD3_3
  Top 0.127: MUX2.13 46.5,56.25 46.5,60 MUX2_IN.13 46.5,60.25 50,63.75 50,69.5 48.5,71 4PAD3.3
4PAD3_4
  Top 0.127: MUX2.14 49.25,56.25 49.25,60 MUX2_IN.14 49,60.25 50.5,61.75 50.5,70.5 48.75,72.25 47.75,72.25 46.5,71 4PAD3.4
4PAD3_5
  Top 0.127: MUX2.15 51.75,56.25 51.75,60 MUX2_IN.15 51.5,60.25 51.5,70 48.5,73 48.5,73.5 4PAD3.5
4PAD3_6
  Top 0.127: MUX2.16 54.25,56.25 54.25,60 MUX2_IN.16 54,60.25 54,69.5 48.5,75 47,75 45.75,73.75 4PAD3.6
6PAD1_3
  Top 0.127: MUX3_IN.1 56.75,56.25 56.75,60 MUX3.1 56.75,60.25 56.75,69.5 59.25,72 60.25,72 61.5,70.75 62.25,70.75 6PAD1.3
6PAD1_4
  Top 0.127: 59,60 59,56.25 MUX3_IN.2 | 59,60 58.25,60.75 58.25,68.75 59.5,70 59.5,70.5 6PAD1.4 | 59,60 MUX3.2
6PAD1_5
  Top 0.127: MUX3_IN.3 61.75,56.25 61.75,60 MUX3.3 61.75,60.25 64,62.5 64,70.75 62.5,72.25 62.5,73.25 6PAD1.5
6PAD1_6
  Top 0.127: MUX3_IN.4 64.5,56.25 64.5,60 MUX3.4 64.5,60.25 64.5,72.75 62.75,74.5 61.75,74.5 60.75,73.5 59.75,73.5 6PAD1.6
6PAD1_7
  Top 0.127: MUX3_IN.5 67,56.25 67,60 MUX3.5 66.75,60.25 66.75,71.25 62.5,75.5 62.5,75.75 6PAD1.7
6PAD1_8
  Top 0.127: MUX3_IN.6 69.5,56.25 69.5,60 MUX3.6 69.25,60.25 69.25,70.5 62.5,77.25 61,77.25 59.75,76 6PAD1.8
6PAD2_3
  Top 0.127: MUX3_IN.7 72,56.25 72,60 MUX3.7 72,60.25 70.75,61.5 70.75,70.5 72.25,72 73.25,72 74.5,70.75 75.25,70.75 6PAD2.3
6PAD2_4
  Top 0.127: 74.25,60 74.25,56.25 MUX3_IN.8 | 74.25,60 71.25,63 71.25,68.75 72.5,70 72.5,70.5 6PAD2.4 | 74.25,60 MUX3.8
6PAD2_5
  Top 0.127: MUX3_IN.9 77.25,56.25 77.25,60 MUX3.9 77,60.25 77,70.75 75.5,72.25 75.5,73.25 6PAD2.5
6PAD2_6
  Top 0.127: MUX3_IN.10 79.5,56.25 79.5,60 MUX3.10 79.5,60.25 79.5,70.75 75.75,74.5 74.75,74.5 73.75,73.5 72.75,73.5 6PAD2.6
6PAD2_7
  Top 0.127: MUX3_IN.11 82.25,56.25 82.25,60 MUX3.11 82,60.25 82,69 75.5,75.5 75.5,75.75 6PAD2.7
6PAD2_8
  Top 0.127: MUX3_IN.12 84.75,56.25 84.75,60 MUX3.12 84.5,60.25 84,60.75 84,68.75 75.5,77.25 74,77.25 72.75,76 6PAD2.8
6PAD3_3
  Top 0.127: MUX3_IN.13 87.25,56.25 87.25,60 MUX3.13 87,60.25 90,63.25 90,69 6PAD3.3
6PAD3_4
  Top 0.127: MUX3_IN.14 89.75,56.25 89.75,60 MUX3.14
  Bottom 0.127: 6PAD3.4 85.75,70.5 87,69.25 87,61.75 87.75,61.75 89.25,60.25 89.5,60.25 MUX3.14
6PAD3_5
  Top 0.127: MUX3_IN.15 92.5,56.25 92.5,60 MUX3.15 92.5,60.25 92.5,68.25 88.5,72.25 88.5,73.25 6PAD3.5
6PAD3_6
  Top 0.127: MUX3_IN.16 94.75,56.25 94.75,60 MUX3.16
  Bottom 0.127: 6PAD3.6 87,72 88.75,72 94.5,66.25 94.5,60.25 94.75,60.25 MUX3.16
6PAD3_7
  Top 0.127: MUX4.1 MUX4_IN.1
  Bottom 0.127: 6PAD3.7 88.5,75.75 96.75,67.5 96.75,23 95.25,23 MUX4.1
6PAD3_8
  Top 0.127: MUX4_IN.2 92.75,19 92.75,22.75 MUX4.2
  Bottom 0.127: 6PAD3.8 85.75,75.75 87,74.5 88.75,74.5 96.25,67 96.25,24.25 93.75,24.25 92.5,23 MUX4.2
COAX1_3
  Top 0.127: MUX1_IN.1 54.75,22.75 54.75,19 MUX1.1
  Bottom 0.127: COAX1.3 53.5,6.75 53.5,7.75 53.75,7.75 55.25,9.25 55.25,18.75 54.75,18.75 MUX1.1
COAX1_4
  Top 0.127: COAX1.4 50.5,6.75 50.5,7.75 49.25,9 49.25,15.75 52.25,18.75 MUX1.2 52,19 52,22.75 MUX1_IN.2
COAX1_5
  Top 0.127: MUX1_IN.3 49.75,22.75 49.75,19 MUX1.3
  Bottom 0.127: COAX1.5 54.75,10.75 54.75,17.25 51.5,17.25 50,18.75 49.75,18.75 MUX1.3
COAX1_6  (via drill 0.3)
  Top 0.127: v47,13 47,18.75 MUX1.4 46.75,19 46.75,22.75 MUX1_IN.4
  Bottom 0.127: v47,13 COAX1.6
COAX1_7
  Top 0.127: MUX1.5 44.5,19 44.5,22.75 MUX1_IN.5
  Bottom 0.127: COAX1.7 53.25,12 48,17.25 46.25,17.25 44.75,18.75 44.5,18.75 MUX1.5
COAX2_3
  Top 0.127: COAX2.3 42.5,6.75 42.5,7.75 43.75,9 43.75,17 42,18.75 MUX1.6 42,19 42,22.75 MUX1_IN.6
COAX2_4
  Top 0.127: COAX2.4 39.5,6.75 39.5,7.75 38.25,9 38.25,17.5 39.5,18.75 MUX1.7 39.5,19 39.5,22.75 MUX1_IN.7
COAX2_5
  Top 0.127: MUX1_IN.8 37,22.75 37,19 MUX1.8
  Bottom 0.127: COAX2.5 43.75,10.75 43.75,16.25 39.75,16.25 37.25,18.75 37,18.75 MUX1.8
COAX2_6  (via drill 0.3)
  Top 0.127: v34.5,14.5 34.5,18.75 MUX1.9 34.25,19 34.25,22.75 MUX1_IN.9
  Bottom 0.127: v34.5,14.5 COAX2.6
COAX2_7
  Top 0.127: MUX1.10 31.5,19 31.5,22.75 MUX1_IN.10
  Bottom 0.127: COAX2.7 42.25,12 37,17.25 33.75,17.25 32.25,18.75 MUX1.10
COAX3_3
  Top 0.127: COAX3.3 19.5,6.75 19.5,7.25 29,16.75 29,18.75 MUX1.11 29.25,19 29.25,22.75 MUX1_IN.11
COAX3_4
  Top 0.127: COAX3.4 16.75,6.75 17.5,6.75 18.75,8 19.75,8 26.5,14.75 26.5,18.75 MUX1.12 26.75,19 26.75,22.75 MUX1_IN.12
COAX3_5
  Top 0.127: COAX3.5 19.5,9.5 19.5,10 24,14.5 24,18.75 MUX1.13 24.25,19 24.25,22.75 MUX1_IN.13
COAX3_6
  Top 0.127: COAX3.6 16.5,9.5 16.5,10 15.25,11.25 15.25,12.75 21.5,19 MUX1.14 21.75,19 21.75,22.75 MUX1_IN.14
COAX3_7  (via drill 0.3)
  Top 0.127: v20,16.75 19.5,16.25 19.5,12 COAX3.7 | MUX1_IN.15 19,22.75 19,19 MUX1.15
  Bottom 0.127: v20,16.75 19,17.75 19,18.75 MUX1.15
COAX4_3
  Top 0.127: MUX1_IN.16 MUX1.16
  Bottom 0.127: COAX4.3 29,8 29,10.5 27,10.5 21.25,16.25 19.5,16.25 17,18.75 MUX1.16
COAX4_4
  Top 0.127: MUX2_IN.1 16,60 16,56.25 MUX2.1
  Bottom 0.127: COAX4.4 27.5,6.75 19,15.25 12.25,15.25 2.75,24.75 2.75,56 16,56 MUX2.1
COAX4_5  (via drill 0.3)
  Top 0.127: v24.75,36.25 33,28 33,12.5 30.5,10 30.5,9.5 COAX4.5 | v24.75,39 24.75,39.5 18.75,45.5 18.75,56 MUX2.2 18.75,56.25 18.75,60 MUX2_IN.2
  Bottom 0.127: v24.75,39 v24.75,36.25
COAX4_6
  Top 0.127: MUX2_IN.3 21.25,60 21.25,56.25 MUX2.3
  Bottom 0.127: COAX4.6 21.25,15.75 17.75,15.75 9,24.5 9,31.25 6.25,31.25 3.25,34.25 3.25,54.75 19.25,54.75 20.5,56 21,56 MUX2.3
COAX4_7  (via drill 0.3)
  Top 0.127: v36.5,16.75 38,18.25 38,29.25 46.25,37.5 46.25,42.25 33.75,54.75 25.25,54.75 23.75,56.25 | 23.75,56.25 23.75,60 MUX2_IN.4 | 23.75,56.25 MUX2.4
  Bottom 0.127: v36.5,16.75 35.25,16.75 30.5,12 COAX4.7
EMPTY
  Top 0.127: MUX4_IN.16 57.25,19 57.25,22.75 MUX4.16
ENC1_2
  Top 0.127: ENC1.2 87,6.75 90,9.75 90,18.75 MUX4_IN.3 90.25,19 90.25,22.75 MUX4.3
ENC1_3
  Top 0.127: MUX4.4 87.75,22.75 87.75,19 MUX4_IN.4
  Bottom 0.127: ENC1.3 87,9.25 88.5,10.75 88.5,18.75 87.75,18.75 MUX4_IN.4
ENC1_4
  Top 0.127: MUX4.5 85.25,22.75 85.25,19 MUX4_IN.5
  Bottom 0.127: ENC1.4 87,11.75 85.25,13.5 85.25,18.75 MUX4_IN.5
ENC2_2
  Top 0.127: MUX4.6 82.5,22.75 82.5,19 MUX4_IN.6
  Bottom 0.127: ENC2.2 80,6.75 82.25,9 82.25,18.75 82.5,18.75 MUX4_IN.6
ENC2_3
  Top 0.127: ENC2.3 80,9.25 78.5,10.75 78.5,16.75 80,18.25 MUX4_IN.7 80.25,19 80.25,22.75 MUX4.7
ENC2_4
  Top 0.127: MUX4.8 77.5,22.75 77.5,19 MUX4_IN.8
  Bottom 0.127: ENC2.4 80,11.75 77.75,14 77.75,18.75 77.5,18.75 MUX4_IN.8
GND
  pour Top: 0,79 0,1 1,0 100,0 100,78 99,79 1,79
  pour Bottom: 0,79 100,79 100,0 0,0
S0
  Top 0.127: MUX4_OUT.4 77.25,38 75,40.25 75,41 MUX3_OUT.4 | 36.25,38 34.25,36 25.75,36 25,36.75 7.5,36.75 MASTER_OUT.3 | 36.25,38 37.75,39.5 37.75,41.25 36.75,42.25 35.25,42.25 34,41 MUX2_OUT.4 | 36.25,38 MUX1_OUT.4
  Bottom 0.127: MUX2_OUT.4 34.25,41 35.75,42.5 61.75,42.5 62,42.75 73,42.75 74.75,41 MUX3_OUT.4
S1
  Top 0.127: MUX4_OUT.5 75,38 76.25,36.75 78,36.75 78.75,37.5 78.75,39.25 77.5,40.5 77.5,41 MUX3_OUT.5 | MASTER_OUT.4 4.75,37 5.25,37 6.5,38.25 24,38.25 25.75,36.5 32.25,36.5 33.75,38 MUX1_OUT.5 34,38 34,38.75 36.25,41 MUX2_OUT.5
  Bottom 0.127: MUX1_OUT.5 34.25,38 36,36.25 73,36.25 74.75,38 MUX4_OUT.5
S2  (via drill 0.3)
  Top 0.127: v35.75,35.75 37.75,37.75 37.75,38.5 38.75,39.5 38.75,41 MUX2_OUT.6
  Bottom 0.127: MUX3_OUT.6 79.5,41 78,39.5 74,39.5 72.5,38 MUX4_OUT.6 72.25,38 70.75,39.5 40.5,39.5 39,41 MUX2_OUT.6 | MASTER_OUT.5 25.75,39.5 26,39.25 26.25,39.25 26.5,39.5 29.75,39.5 31.25,38 MUX1_OUT.6 31.75,38 33.25,36.5 35,36.5 v35.75,35.75
S3  (via drill 0.3)
  Top 0.127: MUX4_OUT.7 70,38 71.75,36.25 82.5,36.25 83.75,37.5 83.75,39.75 82.5,41 MUX3_OUT.7 | MUX1_OUT.7 28.25,38 27,39.25 25.75,39.25 v24.25,40.75 24.25,41.25 25.75,42.75 39.5,42.75 41.25,41 | v45.25,39 44.5,39.75 42.5,39.75 41.25,41 | 41.25,41 MUX2_OUT.7
  Bottom 0.127: v24.25,40.75 6,40.75 4.75,39.5 MASTER_OUT.6 | v45.25,39 47.5,36.75 68.5,36.75 69.75,38 MUX4_OUT.7
SIGNAL1  (via drill 0.3)
  Top 0.127: 67.25,38 70.75,34.5 70.75,32 R4.2 | v61.5,43 66.5,38 67.25,38 | 67.25,38 MUX4_OUT.8
  Bottom 0.127: v61.5,43 35.75,43 35.5,42.75 8,42.75 7.5,42.25 MASTER_OUT.7
SIGNAL2
  Bottom 0.127: MUX3_OUT.8 85,41 83.5,42.5 75.5,42.5 71,47 R3.2 69.75,47 68.5,45.75 38,45.75 35.5,43.25 5.75,43.25 4.75,42.25 MASTER_OUT.8
SIGNAL3
  Top 0.127: R2.2 37.5,47 43.5,41 MUX2_OUT.8
  Bottom 0.127: R2.2 9.75,47 7.5,44.75 MASTER_OUT.9
SIGNAL4
  Top 0.127: MUX1_OUT.8 25,38 17,46 6,46 4.75,44.75 MASTER_OUT.10
  Bottom 0.127: MUX1_OUT.8 25.75,38 25.75,37 29.75,33 R1.2
SPEC_3
  Top 0.127: SPEC.3 68,4.75 74.75,11.5 74.75,18.75 MUX4_IN.9 75,19 75,22.75 MUX4.9
SPEC_4
  Top 0.127: MUX4.10 72.5,22.75 72.5,19 MUX4_IN.10
  Bottom 0.127: SPEC.4 65.5,4.75 66.5,5.75 68.5,5.75 72.25,9.5 72.25,18.75 MUX4_IN.10
SPEC_5
  Top 0.127: MUX4.11 70,22.75 70,19 MUX4_IN.11
  Bottom 0.127: SPEC.5 68,7.25 69.5,8.75 69.5,18.75 69.75,18.75 MUX4_IN.11
SPEC_6
  Top 0.127: SPEC.6 65.5,7.25 66.5,8.25 68.25,8.25 69.5,9.5 69.5,16.5 67.25,18.75 MUX4_IN.12 67.25,19 67.25,22.75 MUX4.12
SPEC_7
  Top 0.127: 65,19 66.75,17.25 66.75,11 68,9.75 SPEC.7 | 65,19 65,22.75 MUX4.13 | 65,19 MUX4_IN.13
SPEC_8
  Top 0.127: SPEC.8 65.25,9.75 65.25,10.25 62.25,13.25 62.25,18.75 MUX4_IN.14 62,19 62,22.75 MUX4.14
SPEC_9
  Top 0.127: MUX4_IN.15 59.75,19 59.75,22.75 MUX4.15
  Bottom 0.127: SPEC.9 68,12.25 63,17.25 61.5,17.25 60,18.75 59.75,18.75 MUX4_IN.15
VCC
  Top 0.127: MASTER_OUT.2 4.75,34.25 4.75,24.75 POWER.2 4.75,24.5 4.75,16.25 16.75,4.25 COAX3.2 | 40.25,36.25 40.25,36.75 41.5,38 MUX1_OUT.2 | 40.25,36.25 40.25,33 R1.1 | 40.25,36.25 44.5,36.25 45.75,37.5 45.75,41 40.25,46.5 40.25,47 R2.1 | 81.25,42.75 81.25,39.75 82.5,38.5 82.5,38 MUX4_OUT.2 | 81.25,42.75 81.25,47 R3.1 | 81.25,42.75 71.75,42.75 70,41 MUX3_OUT.2
  Bottom 0.127: SPEC.2 65.25,2 64.75,2.5 52.5,2.5 51,4 50.75,4 COAX1.2 50.5,4 49.75,4 48.25,2.5 41.25,2.5 39.75,4 COAX2.2 39.5,4 38,2.5 29.5,2.5 28,4 27.75,4 COAX4.2 27.5,4 26.75,4 25.25,2.5 18.25,2.5 16.75,4 COAX3.2 | MUX2_OUT.2 29,41 30.75,39.25 31.5,39.25 31.75,39.5 40,39.5 41.5,38 MUX1_OUT.2 | R4.1 81.25,32 82.5,33.25 82.5,38 MUX4_OUT.2 | 4PAD1.2 21.75,68.25 23.25,66.75 31.5,66.75 33,68.25 33.5,68.25 4PAD2.2 33.75,68.25 34,68.25 35.5,66.75 42.75,66.75 | 42.75,66.75 44,66.75 45.5,68.25 4PAD3.2 45.75,68.25 47.25,66.75 57.5,66.75 58.75,68 59.5,68 6PAD1.2 59.75,68 61.25,66.5 70.25,66.5 71.75,68 72.5,68 6PAD2.2 72.75,68 73,68 74.5,66.5 75.75,66.5 | 75.75,66.5 84,66.5 85.5,68 6PAD3.2 | 75.75,66.5 75.75,52.25 81,47 R3.1 | 42.75,66.75 42.75,49.5 40.25,47 R2.1 | R1.1 39,33 37.75,31.75 7.25,31.75 4.75,34.25 MASTER_OUT.2

### Text on the board
tPlace: 0 | 1 | 2 | 3 | 4 | 5 | 6 | 7 | 8 | 9 | 10 | 11 | 12 | 13 | 14 | 15 | 0 | 1 | 2 | 3 | 4 | 5 | 6 | 7 | 8 | 9 | 10 | 11 | 12 | 13 | 14 | 15 | MUX Adapter Rev. 2.0 / Steivan Claglüna | VCC | GND | 15 | 14 | 13 | 12 | 11 | 10 | 9 | 8 | 7 | 6 | 5 | 4 | 3 | 2 | 1 | 0 | 15 | 14 | 13 | 12 | 11 | 10 | 9 | 8 | 7 | 6 | 5 | 4 | 3 | 2 | 1 | 0
bPlace: MUX Adapter Rev. 2.0 / Steivan Claglüna
tNames: Pullup | Pullup | MUX2 | SIG | VCC | SIG | VCC | MUX3 | SIG4 | SIG3 | SIG2 | SIG1 | S3 | S2 | S1 | S0 | VCC | GND | Pullup | SIG | VCC | Pullup | SIG | VCC | MUX1 | MUX4
bNames: SIG4 | SIG3 | SIG2 | SIG1 | S3 | S2 | S1 | S0 | VCC | GND